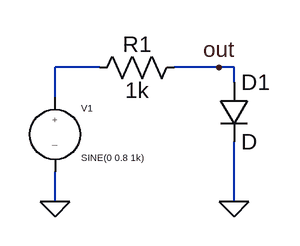
[diagram p0: schematic fft-1.asc]
fft-1.asc, the LTspice schematic file:
Version 4
SHEET 1 880 680
WIRE 96 128 48 128
WIRE 224 128 176 128
WIRE 240 128 224 128
WIRE 240 144 240 128
WIRE 48 160 48 128
WIRE 48 272 48 240
WIRE 240 272 240 208
FLAG 48 272 0
FLAG 240 272 0
FLAG 224 128 out
SYMBOL diode 224 144 R0
SYMATTR InstName D1
SYMBOL res 80 144 R270
WINDOW 0 25 56 VTop 2
WINDOW 3 7 56 VBottom 2
SYMATTR InstName R1
SYMATTR Value 1k
SYMBOL source-V 48 144 R0
WINDOW 123 0 0 Left 2
WINDOW 39 0 0 Left 2
SYMATTR InstName V1
SYMATTR Value SINE(0 0.8 1k)

The netlist it stands for:
* fft-1.asc
D1 out 0 D
R1 N001 out 1k
V1 N001 0 SINE(0 0.8 1k)
.model D D
.lib standard.dio
.backanno
.end